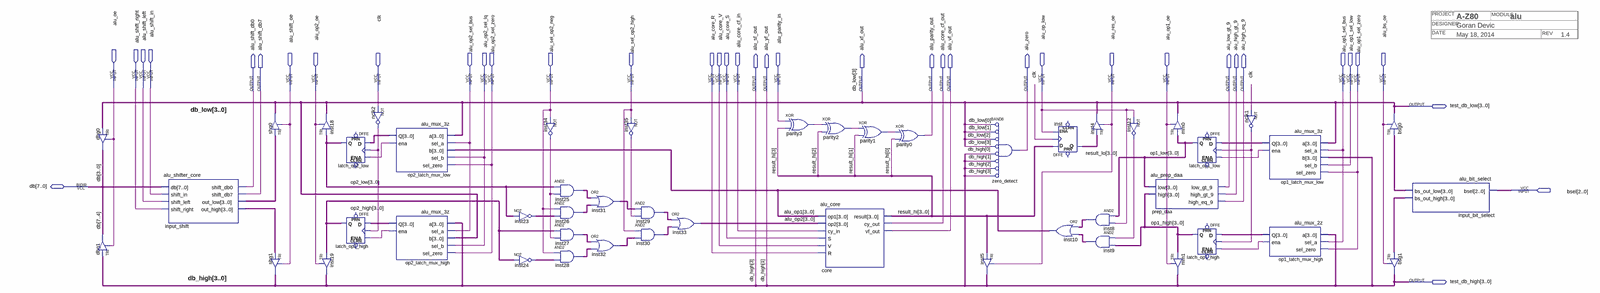
[diagram p0: schematic sheet, whole]
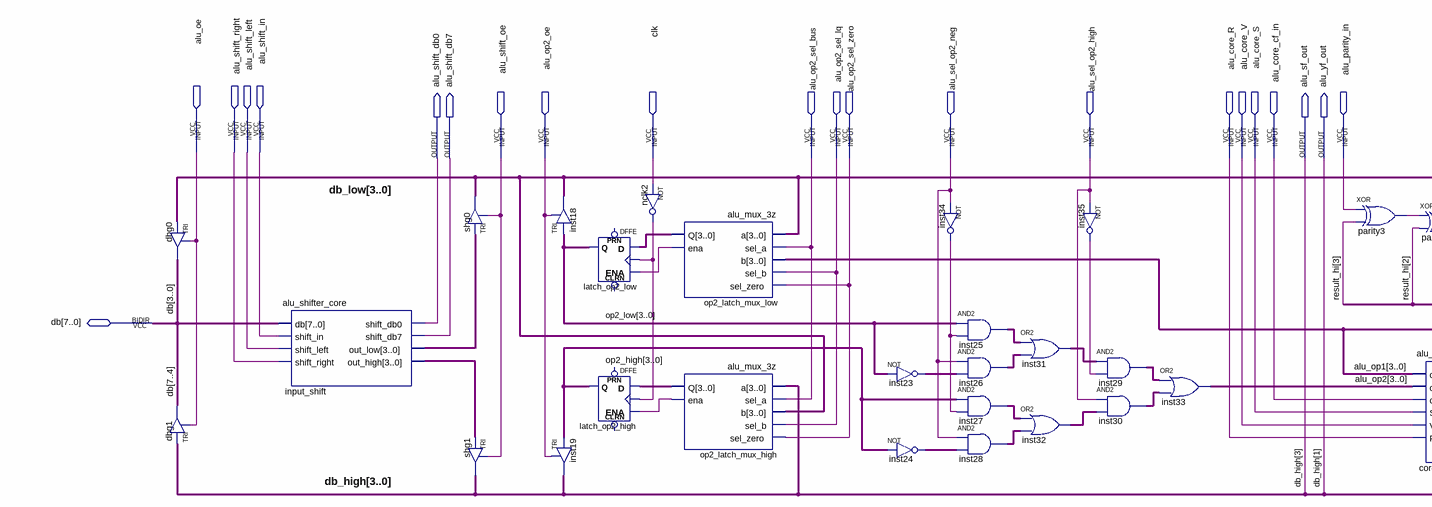
[diagram p1: schematic sheet, left part]
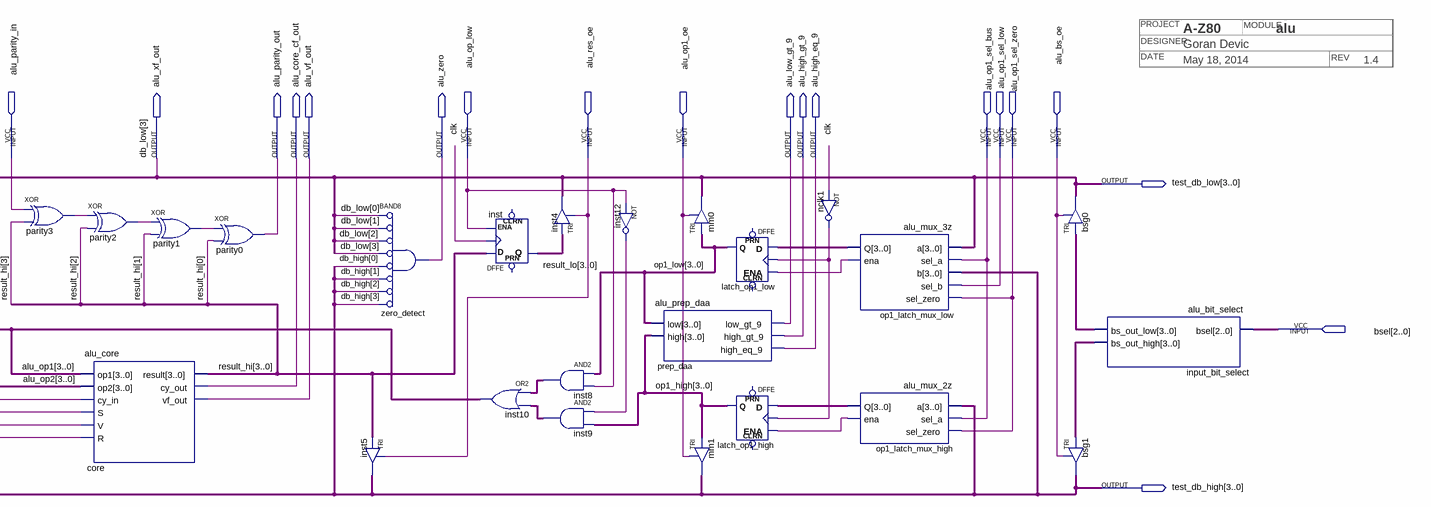
[diagram p2: schematic sheet, right part]
// Quartus schematic alu.bdf as structural Verilog: 49 symbols, 40 pins
// Title block: PROJECT: A-Z80; MODULE: alu; DESIGNER: Goran Devic; DATE: May 18, 2014; REV: 1.4
module alu (
  input  alu_oe,
  input  alu_shift_right,
  input  alu_shift_left,
  input  alu_shift_in,
  input  alu_shift_oe,
  input  alu_op2_oe,
  input  clk,
  input  alu_op2_sel_bus,
  input  alu_op2_sel_lq,
  input  alu_op2_sel_zero,
  input  alu_sel_op2_neg,
  input  alu_sel_op2_high,
  input  alu_core_R,
  input  alu_core_V,
  input  alu_core_S,
  input  alu_core_cf_in,
  input  alu_parity_in,
  input  alu_op_low,
  input  alu_res_oe,
  input  alu_op1_oe,
  input  alu_op1_sel_bus,
  input  alu_op1_sel_low,
  input  alu_op1_sel_zero,
  input  alu_bs_oe,
  input  [2:0] bsel,
  inout  [7:0] db,
  output alu_shift_db0,
  output alu_shift_db7,
  output alu_sf_out,
  output alu_yf_out,
  output alu_xf_out,
  output alu_parity_out,
  output alu_core_cf_out,
  output alu_vf_out,
  output alu_zero,
  output alu_low_gt_9,
  output alu_high_gt_9,
  output alu_high_eq_9,
  output [3:0] test_db_low,
  output [3:0] test_db_high
);

  wire inst12_out, inst34_out, inst35_out, nclk1_out, nclk2_out, op1_latch_mux_high_ena,
       op1_latch_mux_low_ena, op2_latch_mux_high_ena, op2_latch_mux_low_ena, parity1_out, parity2_out,
       parity3_out;
  wire [3:0] alu_op1, alu_op2, input_bit_select_bs_out_high, input_bit_select_bs_out_low,
       input_shift_out_high, input_shift_out_low, inst8_out, inst9_out, inst23_out, inst24_out, inst25_out,
       inst26_out, inst27_out, inst28_out, inst29_out, inst30_out, inst31_out, inst32_out, op1_high,
       op1_latch_mux_high_q, op1_latch_mux_low_q, op1_low, op2_high, op2_latch_mux_high_q,
       op2_latch_mux_low_q, op2_low, result_hi, result_lo;

  TRI dbg0[3:0] (.IN({alu_xf_out, test_db_low[2:0]}), .OE(alu_oe), .OUT(db[3:0]));
  TRI dbg1[3:0] (.IN({alu_sf_out, test_db_high[2], alu_yf_out, test_db_high[0]}), .OE(alu_oe), .OUT(db[7:4]));
  alu_shifter_core input_shift (
    .db(db), .shift_in(alu_shift_in), .shift_left(alu_shift_left), .shift_right(alu_shift_right),
    .shift_db0(alu_shift_db0), .shift_db7(alu_shift_db7), .out_low(input_shift_out_low),
    .out_high(input_shift_out_high));
  TRI shg0[3:0] (.IN(input_shift_out_low), .OE(alu_shift_oe), .OUT({alu_xf_out, test_db_low[2:0]}));
  TRI shg1[3:0] (
    .IN(input_shift_out_high), .OE(alu_shift_oe),
    .OUT({alu_sf_out, test_db_high[2], alu_yf_out, test_db_high[0]}));
  TRI inst18[3:0] (.IN(op2_low), .OE(alu_op2_oe), .OUT({alu_xf_out, test_db_low[2:0]}));
  DFFE latch_op2_low[3:0] (
    .D(op2_latch_mux_low_q), .CLK(nclk2_out), .ENA(op2_latch_mux_low_ena), .Q(op2_low));  // open: PRN, CLRN
  DFFE latch_op2_high[3:0] (
    .D(op2_latch_mux_high_q), .CLK(nclk2_out), .ENA(op2_latch_mux_high_ena), .Q(op2_high));  // open: PRN, CLRN
  TRI inst19[3:0] (.IN(op2_high), .OE(alu_op2_oe), .OUT({alu_sf_out, test_db_high[2], alu_yf_out, test_db_high[0]}));
  not nclk2 (nclk2_out, clk);
  alu_mux_3z op2_latch_mux_low (
    .a({alu_xf_out, test_db_low[2:0]}), .sel_a(alu_op2_sel_bus), .b(alu_op1), .sel_b(alu_op2_sel_lq),
    .sel_zero(alu_op2_sel_zero), .Q(op2_latch_mux_low_q), .ena(op2_latch_mux_low_ena));
  alu_mux_3z op2_latch_mux_high (
    .a({alu_sf_out, test_db_high[2], alu_yf_out, test_db_high[0]}), .sel_a(alu_op2_sel_bus),
    .b({alu_xf_out, test_db_low[2:0]}), .sel_b(alu_op2_sel_lq), .sel_zero(alu_op2_sel_zero),
    .Q(op2_latch_mux_high_q), .ena(op2_latch_mux_high_ena));
  assign inst23_out = ~op2_low;  // NOT inst23, 4 bits wide
  assign inst24_out = ~op2_high;  // NOT inst24, 4 bits wide
  not inst34 (inst34_out, alu_sel_op2_neg);
  assign inst25_out = op2_low & {4{inst34_out}};  // AND2 inst25, 4 bits wide
  assign inst26_out = {4{alu_sel_op2_neg}} & inst23_out;  // AND2 inst26, 4 bits wide
  assign inst27_out = op2_high & {4{inst34_out}};  // AND2 inst27, 4 bits wide
  assign inst28_out = {4{alu_sel_op2_neg}} & inst24_out;  // AND2 inst28, 4 bits wide
  assign inst31_out = inst25_out | inst26_out;  // OR2 inst31, 4 bits wide
  assign inst32_out = inst27_out | inst28_out;  // OR2 inst32, 4 bits wide
  not inst35 (inst35_out, alu_sel_op2_high);
  assign inst29_out = inst31_out & {4{inst35_out}};  // AND2 inst29, 4 bits wide
  assign inst30_out = {4{alu_sel_op2_high}} & inst32_out;  // AND2 inst30, 4 bits wide
  assign alu_op2 = inst29_out | inst30_out;  // OR2 inst33, 4 bits wide
  xor parity3 (parity3_out, alu_parity_in, result_hi[3]);
  xor parity2 (parity2_out, parity3_out, result_hi[2]);
  alu_core core (
    .op1(alu_op1), .op2(alu_op2), .cy_in(alu_core_cf_in), .S(alu_core_S), .V(alu_core_V), .R(alu_core_R),
    .result(result_hi), .cy_out(alu_core_cf_out), .vf_out(alu_vf_out));
  xor parity1 (parity1_out, parity2_out, result_hi[1]);
  xor parity0 (alu_parity_out, parity1_out, result_hi[0]);
  TRI inst5[3:0] (.IN(result_hi), .OE(alu_res_oe), .OUT({alu_sf_out, test_db_high[2], alu_yf_out, test_db_high[0]}));
  and zero_detect (alu_zero, ~test_db_low[0], ~test_db_low[1], ~test_db_low[2], ~alu_xf_out, ~test_db_high[0], ~alu_yf_out, ~test_db_high[2], ~alu_sf_out);  // BAND8
  DFFE inst[3:0] (.D(result_hi), .CLK(clk), .ENA(alu_op_low), .Q(result_lo));  // open: PRN, CLRN
  assign alu_op1 = inst8_out | inst9_out;  // OR2 inst10, 4 bits wide
  TRI inst4[3:0] (.IN(result_lo), .OE(alu_res_oe), .OUT({alu_xf_out, test_db_low[2:0]}));
  assign inst8_out = op1_low & {4{alu_op_low}};  // AND2 inst8, 4 bits wide
  assign inst9_out = {4{inst12_out}} & op1_high;  // AND2 inst9, 4 bits wide
  not inst12 (inst12_out, alu_op_low);
  alu_prep_daa prep_daa (
    .low(op1_low), .high(op1_high), .low_gt_9(alu_low_gt_9), .high_gt_9(alu_high_gt_9),
    .high_eq_9(alu_high_eq_9));
  TRI mm0[3:0] (.IN(op1_low), .OE(alu_op1_oe), .OUT({alu_xf_out, test_db_low[2:0]}));
  DFFE latch_op1_low[3:0] (
    .D(op1_latch_mux_low_q), .CLK(nclk1_out), .ENA(op1_latch_mux_low_ena), .Q(op1_low));  // open: PRN, CLRN
  DFFE latch_op1_high[3:0] (
    .D(op1_latch_mux_high_q), .CLK(nclk1_out), .ENA(op1_latch_mux_high_ena), .Q(op1_high));  // open: PRN, CLRN
  TRI mm1[3:0] (.IN(op1_high), .OE(alu_op1_oe), .OUT({alu_sf_out, test_db_high[2], alu_yf_out, test_db_high[0]}));
  not nclk1 (nclk1_out, clk);
  alu_mux_3z op1_latch_mux_low (
    .a({alu_xf_out, test_db_low[2:0]}), .sel_a(alu_op1_sel_bus),
    .b({alu_sf_out, test_db_high[2], alu_yf_out, test_db_high[0]}), .sel_b(alu_op1_sel_low),
    .sel_zero(alu_op1_sel_zero), .Q(op1_latch_mux_low_q), .ena(op1_latch_mux_low_ena));
  alu_mux_2z op1_latch_mux_high (
    .a({alu_sf_out, test_db_high[2], alu_yf_out, test_db_high[0]}), .sel_a(alu_op1_sel_bus),
    .sel_zero(alu_op1_sel_zero), .Q(op1_latch_mux_high_q), .ena(op1_latch_mux_high_ena));
  TRI bsg0[3:0] (.IN(input_bit_select_bs_out_low), .OE(alu_bs_oe), .OUT({alu_xf_out, test_db_low[2:0]}));
  TRI bsg1[3:0] (
    .IN(input_bit_select_bs_out_high), .OE(alu_bs_oe),
    .OUT({alu_sf_out, test_db_high[2], alu_yf_out, test_db_high[0]}));
  alu_bit_select input_bit_select (
    .bsel(bsel), .bs_out_low(input_bit_select_bs_out_low), .bs_out_high(input_bit_select_bs_out_high));

  assign {test_db_high[3], test_db_high[1]} = {alu_sf_out, alu_yf_out};
  assign test_db_low[3] = alu_xf_out;

  // Other names for the same wires on the sheet: db_high[3:0] = {alu_sf_out, test_db_high[2], alu_yf_out, test_db_high[0]};
  //   db_low[3:0] = {alu_xf_out, test_db_low[2:0]}
endmodule
